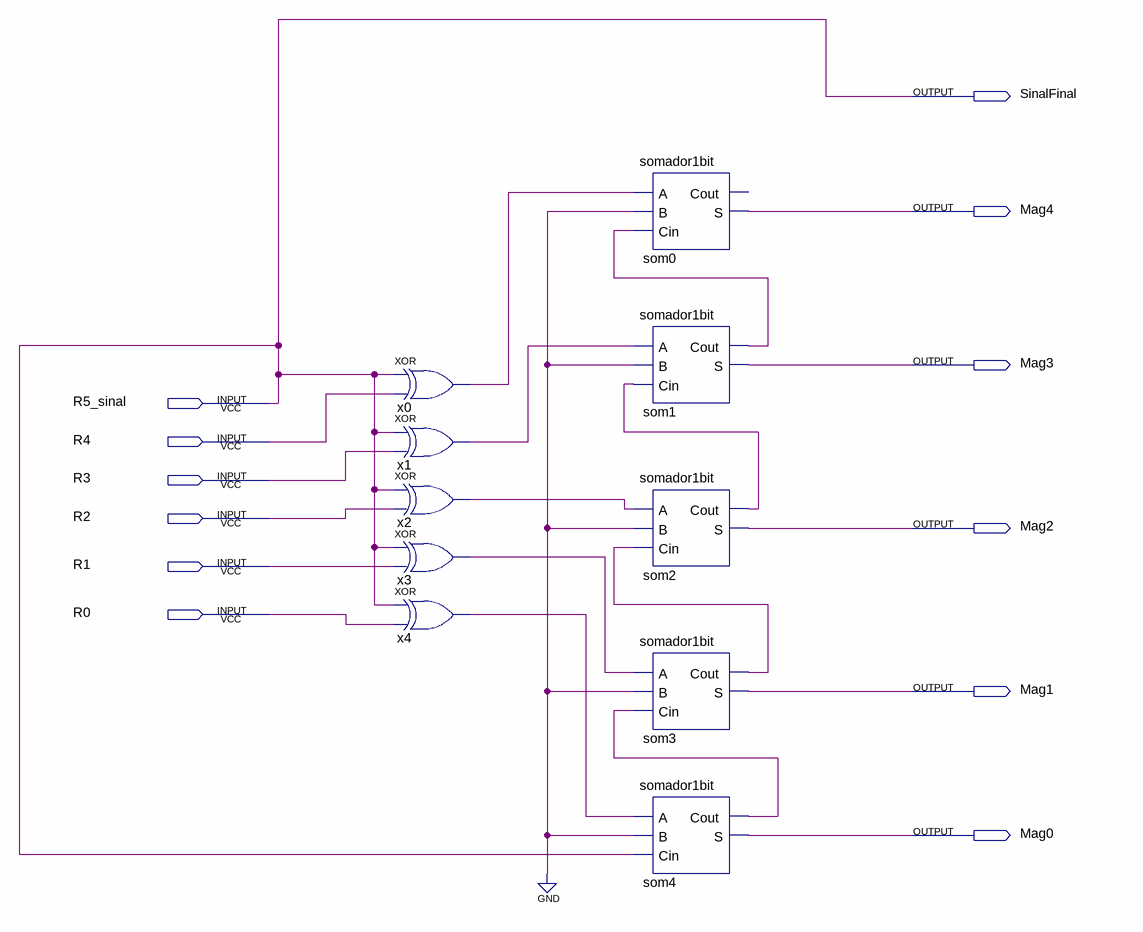
[diagram p0: schematic sheet]
// Quartus schematic conversorSaida.bdf as structural Verilog: 10 symbols, 12 pins
module conversorSaida (
  input  R5_sinal,
  input  R4,
  input  R3,
  input  R2,
  input  R1,
  input  R0,
  output SinalFinal,
  output Mag4,
  output Mag3,
  output Mag2,
  output Mag1,
  output Mag0
);

  wire som1_cout, som2_cout, som3_cout, som4_cout, x0_out, x1_out, x2_out, x3_out, x4_out;

  xor x0 (x0_out, R5_sinal, R4);
  xor x1 (x1_out, R5_sinal, R3);
  xor x2 (x2_out, R5_sinal, R2);
  xor x3 (x3_out, R5_sinal, R1);
  xor x4 (x4_out, R5_sinal, R0);
  somador1bit som0 (.A(x0_out), .B(1'b0), .Cin(som1_cout), .S(Mag4));  // open: Cout
  somador1bit som1 (.A(x1_out), .B(1'b0), .Cin(som2_cout), .Cout(som1_cout), .S(Mag3));
  somador1bit som2 (.A(x2_out), .B(1'b0), .Cin(som3_cout), .Cout(som2_cout), .S(Mag2));
  somador1bit som3 (.A(x3_out), .B(1'b0), .Cin(som4_cout), .Cout(som3_cout), .S(Mag1));
  somador1bit som4 (.A(x4_out), .B(1'b0), .Cin(R5_sinal), .Cout(som4_cout), .S(Mag0));

  assign SinalFinal = R5_sinal;
endmodule
